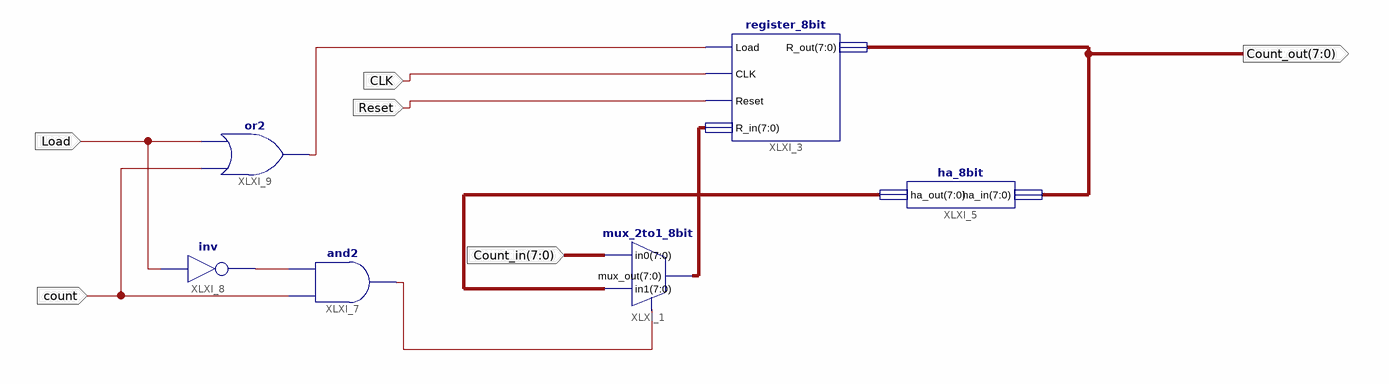
[diagram p0: schematic sheet 1]
// Xilinx ISE schematic lab_counter.sch (spartan3e) as structural Verilog: 6 symbols, 6 ports
module lab_counter (
  input  [7:0] Count_in,
  input  Load,
  input  count,
  input  CLK,
  input  Reset,
  output [7:0] Count_out
);

  wire XLXN_3, XLXN_5, XLXN_10;
  wire [7:0] XLXN_2, XLXN_18;

  mux_2to1_8bit XLXI_1 (.in0(Count_in), .sel(XLXN_3), .mux_out(XLXN_18), .in1(XLXN_2));
  register_8bit XLXI_3 (.Load(XLXN_10), .CLK(CLK), .Reset(Reset), .R_in(XLXN_18), .R_out(Count_out));
  ha_8bit XLXI_5 (.ha_in(Count_out), .ha_out(XLXN_2));
  and XLXI_7 (XLXN_3, count, XLXN_5);
  not XLXI_8 (XLXN_5, Load);
  or XLXI_9 (XLXN_10, count, Load);
endmodule
